# EAGLE design shield-iblock (EAGLE 9.6.1)
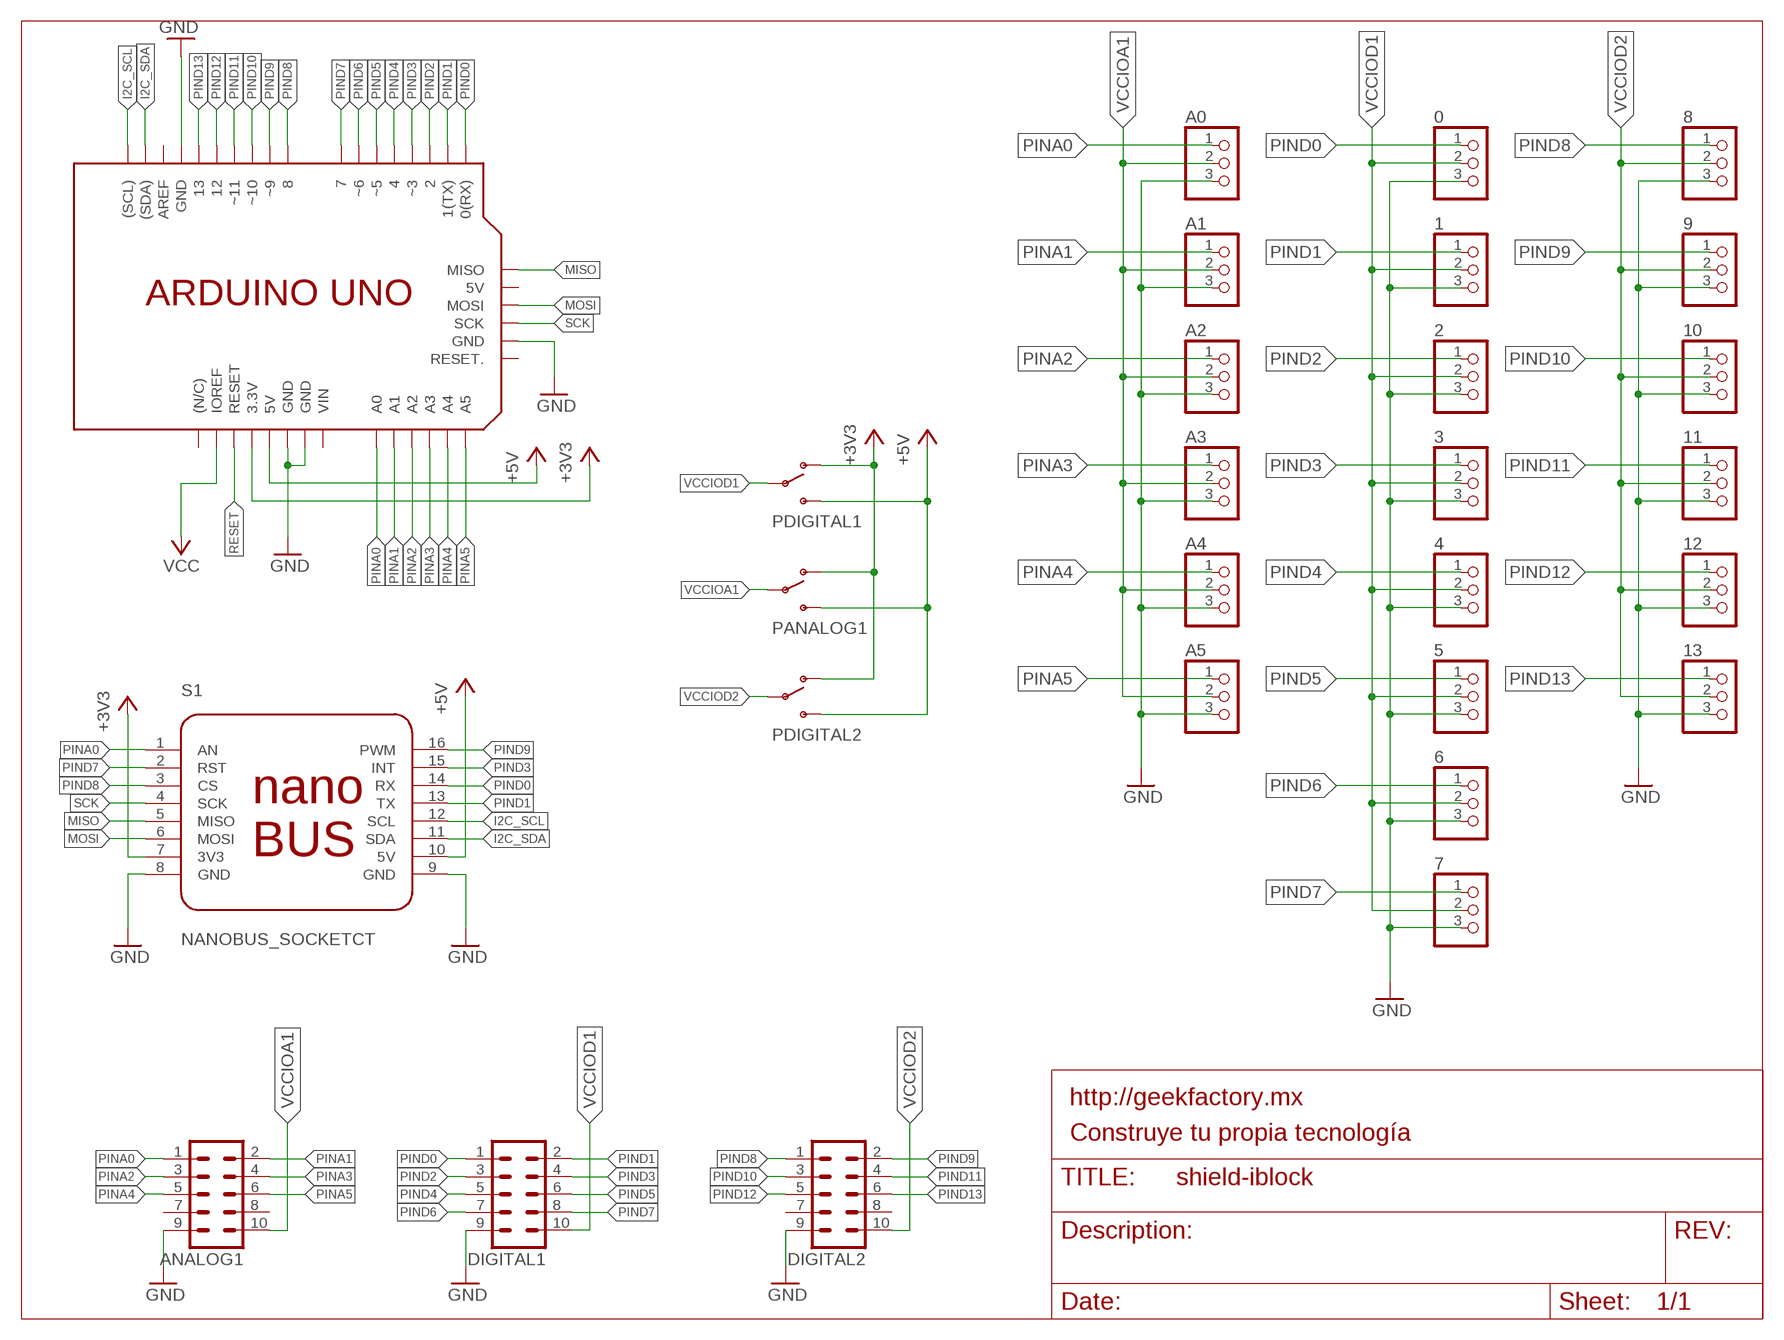
[diagram p0: schematic, sheet 1]

## Parts
0  PINHD-1X3  [1X03]
1  PINHD-1X3  [1X03]
2  PINHD-1X3  [1X03]
3  PINHD-1X3  [1X03]
4  PINHD-1X3  [1X03]
5  PINHD-1X3  [1X03]
6  PINHD-1X3  [1X03]
7  PINHD-1X3  [1X03]
8  PINHD-1X3  [1X03]
9  PINHD-1X3  [1X03]
10  PINHD-1X3  [1X03]
11  PINHD-1X3  [1X03]
12  PINHD-1X3  [1X03]
13  PINHD-1X3  [1X03]
A0  PINHD-1X3  [1X03]
A1  PINHD-1X3  [1X03]
A2  PINHD-1X3  [1X03]
A3  PINHD-1X3  [1X03]
A4  PINHD-1X3  [1X03]
A5  PINHD-1X3  [1X03]
ANALOG1  MA05-2A  [MA05-2A]
ARDUINO1  ARDUINO_UNO_NHNBR  [ARDUINO_UNO_NH_NB_ROUND]
DIGITAL1  MA05-2A  [MA05-2A]
DIGITAL2  MA05-2A  [MA05-2A]
PANALOG1  SWITCH-SPSTPTH  [SWITCH-SPDT]
PDIGITAL1  SWITCH-SPSTPTH  [SWITCH-SPDT]
PDIGITAL2  SWITCH-SPSTPTH  [SWITCH-SPDT]
S1  NANOBUS_SOCKETCT  [NANOBUS_CONNECTOR_CLEAR_TOP]

## Nets
+3V3: ARDUINO1.3V3(3.3V) PANALOG1.1(O) PDIGITAL1.1(O) PDIGITAL2.1(O) S1.7(3V3)
+5V: ARDUINO1.5V PANALOG1.3(S) PDIGITAL1.3(S) PDIGITAL2.3(S) S1.10(5V)
GND: 0.3 1.3 2.3 3.3 4.3 5.3 6.3 7.3 8.3 9.3 10.3 11.3 12.3 13.3 A0.3 A1.3 A2.3 A3.3 A4.3 A5.3 ANALOG1.9 ARDUINO1.GND ARDUINO1.GND.(GND) ARDUINO1.GND..(GND) ARDUINO1.GND_(GND) DIGITAL1.9 DIGITAL2.9 S1.8(GND) S1.9(GND)
I2C_SCL: ARDUINO1.SCL((SCL)) S1.12(SCL)
I2C_SDA: ARDUINO1.SDA((SDA)) S1.11(SDA)
MISO: ARDUINO1.MISO S1.5(MISO)
MOSI: ARDUINO1.MOSI S1.6(MOSI)
PINA0: A0.1 ANALOG1.1 ARDUINO1.A0 S1.1(AN)
PINA1: A1.1 ANALOG1.2 ARDUINO1.A1
PINA2: A2.1 ANALOG1.3 ARDUINO1.A2
PINA3: A3.1 ANALOG1.4 ARDUINO1.A3
PINA4: A4.1 ANALOG1.5 ARDUINO1.A4
PINA5: A5.1 ANALOG1.6 ARDUINO1.A5
PIND0: 0.1 ARDUINO1.0(0(RX)) DIGITAL1.1 S1.14(RX)
PIND1: 1.1 ARDUINO1.1(1(TX)) DIGITAL1.2 S1.13(TX)
PIND2: 2.1 ARDUINO1.2 DIGITAL1.3
PIND3: 3.1 ARDUINO1.3(~3) DIGITAL1.4 S1.15(INT)
PIND4: 4.1 ARDUINO1.4 DIGITAL1.5
PIND5: 5.1 ARDUINO1.5(~5) DIGITAL1.6
PIND6: 6.1 ARDUINO1.6(~6) DIGITAL1.7
PIND7: 7.1 ARDUINO1.7 DIGITAL1.8 S1.2(RST)
PIND8: 8.1 ARDUINO1.8 DIGITAL2.1 S1.3(CS)
PIND9: 9.1 ARDUINO1.9(~9) DIGITAL2.2 S1.16(PWM)
PIND10: 10.1 ARDUINO1.10(~10) DIGITAL2.3
PIND11: 11.1 ARDUINO1.11(~11) DIGITAL2.4
PIND12: 12.1 ARDUINO1.12 DIGITAL2.5
PIND13: 13.1 ARDUINO1.13 DIGITAL2.6
RESET: ARDUINO1.RST(RESET)
SCK: ARDUINO1.SCK S1.4(SCK)
VCC: ARDUINO1.IOR(IOREF)
VCCIOA1: A0.2 A1.2 A2.2 A3.2 A4.2 A5.2 ANALOG1.10 PANALOG1.2(P)
VCCIOD1: 0.2 1.2 2.2 3.2 4.2 5.2 6.2 7.2 DIGITAL1.10 PDIGITAL1.2(P)
VCCIOD2: 8.2 9.2 10.2 11.2 12.2 13.2 DIGITAL2.10 PDIGITAL2.2(P)
Unconnected: ANALOG1.7 ANALOG1.8 ARDUINO1.+5V(5V) ARDUINO1.AREF ARDUINO1.NC((N/C)) ARDUINO1.RESET. ARDUINO1.VIN DIGITAL2.7 DIGITAL2.8

## Library data of the parts
0 1-13 A0 A1-A5 = adafruit:PINHD-1X3: PIN HEADER
ANALOG1 DIGITAL1 DIGITAL2 = various-electromechanical:MA05-2: PIN HEADER
ARDUINO1 = arduino 2:ARDUINO_UNO
PANALOG1 PDIGITAL1 PDIGITAL2 = various-electromechanical:SWITCH-SPST: SPST Switch Simple slide switch. Spark Fun Electronics SKU : COM-00102
S1 = nanobus:NANOBUS_SOCKET

## Board
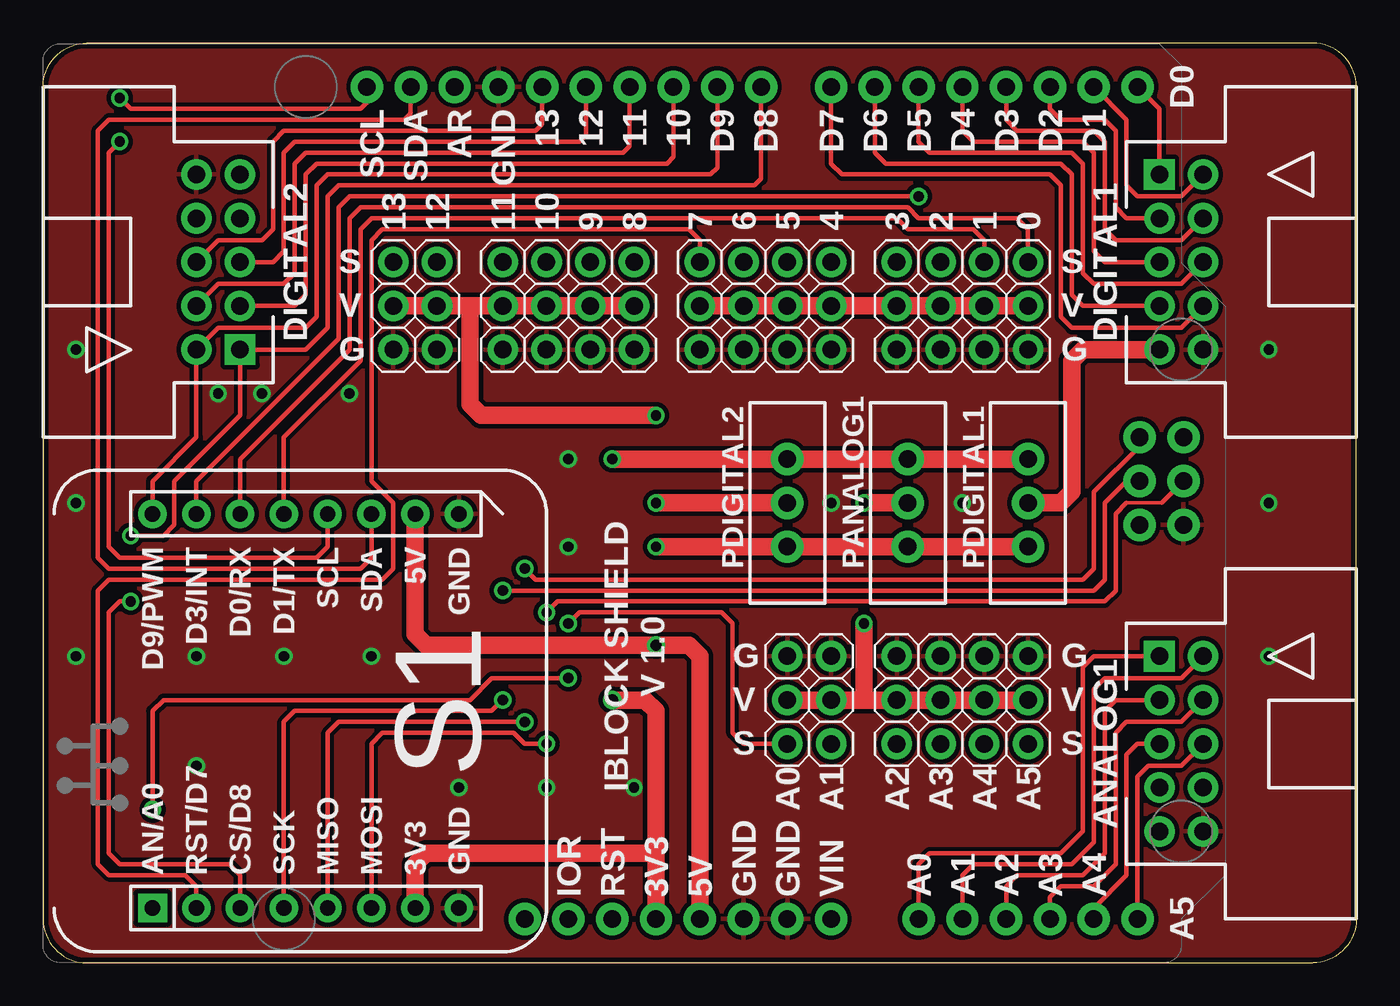
[diagram p1: board, top side]
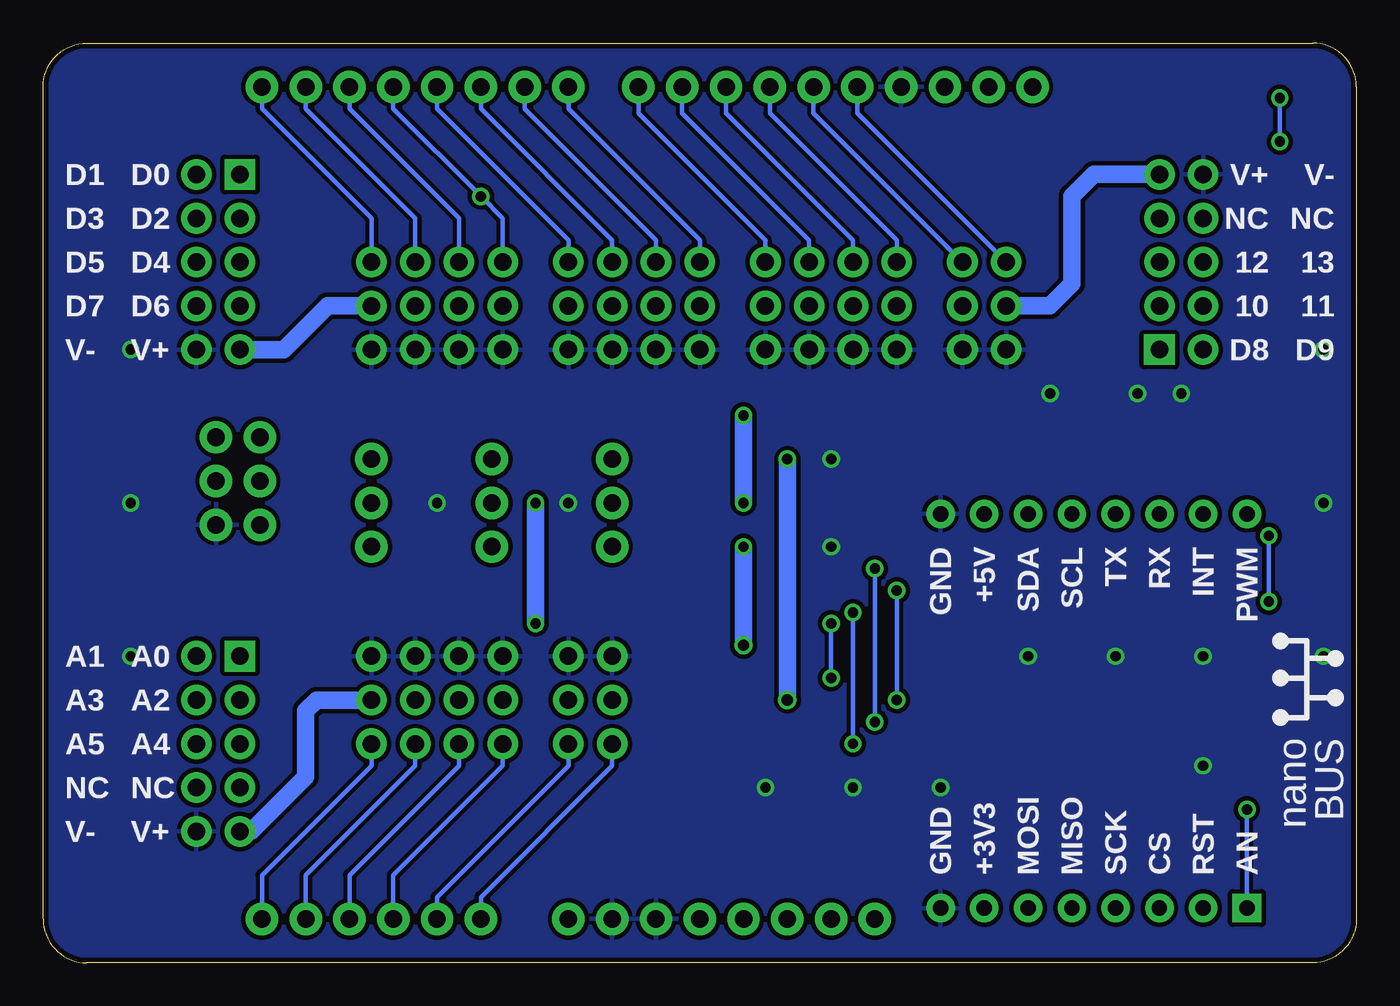
[diagram p2: board, bottom side, seen from below]

Size 76.2 x 53.34 mm. Coordinates in mm from the lower left corner, seen from the top.
Outline: 2.54,0 73.66,0 arc90 76.2,2.54 76.2,50.8 arc90 73.66,53.34 2.54,53.34 arc90 0,50.8 0,2.54 arc90 2.54,0
Copper layers (1*16): Top 0.035mm / dielectric 1.5mm / Bottom 0.035mm
Design rules "10mil_generic": minimum track width 10mil, minimum drill 0.6mm, track to track 10mil, track to pad 10mil, pad to pad 10mil, via to via 10mil, smd to smd 10mil, copper to edge 12mil, drill to drill 8mil, minimum pad ring 15mil, minimum via ring 8mil, stop-mask expansion 4mil, vias tented up to drill 0.6mm, thermal gap 10mil

### Footprints (pad centres in the part's own frame; a part is rotated, then mirrored left to right if it is on the bottom)
1X03 = drill 1.016: 1 -2.54,0; 2 0,0; 3 2.54,0
MA05-2A = drill 1.016 square: 1 1.27,-5.08 | drill 1.016: 2 -1.27,-5.08; 3 1.27,-2.54; 4 -1.27,-2.54; 5 1.27,0; 6 -1.27,0; 7 1.27,2.54; 8 -1.27,2.54; 9 -1.27,5.08; 10 1.27,5.08
ARDUINO_UNO_NH_NB_ROUND = drill 1.016 pad 1.88: 0 63.5,50.8; 1 60.96,50.8; 2 58.42,50.8; 3 55.88,50.8; 3V3 35.56,2.54; 4 53.34,50.8; 5 50.8,50.8; 5V 38.1,2.54; 6 48.26,50.8; 7 45.72,50.8; 8 41.656,50.8; 9 39.116,50.8; 10 36.576,50.8; 11 34.036,50.8; 12 31.496,50.8; 13 28.956,50.8; +5V 66.167,30.48; A0 50.8,2.54; A1 53.34,2.54; A2 55.88,2.54; A3 58.42,2.54; A4 60.96,2.54; A5 63.5,2.54; AREF 23.876,50.8; GND 26.416,50.8; GND. 43.18,2.54; GND.. 40.64,2.54; GND_ 66.167,25.4; IOR 30.48,2.54; MISO 63.627,30.48; MOSI 66.167,27.94; NC 27.94,2.54; RESET. 63.627,25.4; RST 33.02,2.54; SCK 63.627,27.94; SCL 18.796,50.8; SDA 21.336,50.8; VIN 45.72,2.54
SWITCH-SPDT = drill 1.016 pad 1.88: 1 0,2.54; 2 0,0; 3 0,-2.54
NANOBUS_CONNECTOR_CLEAR_TOP = drill 0.889 pad 1.676 square: 1 -11.43,8.89 | drill 0.889 pad 1.524: 2 -11.43,6.35; 3 -11.43,3.81; 4 -11.43,1.27; 5 -11.43,-1.27; 6 -11.43,-3.81; 7 -11.43,-6.35; 8 -11.43,-8.89; 9 11.43,-8.89; 10 11.43,-6.35; 11 11.43,-3.81; 12 11.43,-1.27; 13 11.43,1.27; 14 11.43,3.81; 15 11.43,6.35; 16 11.43,8.89

### Placement (x,y rotation side)
0  57.15,38.1 270 top
1  54.61,38.1 270 top
2  52.07,38.1 270 top
3  49.53,38.1 270 top
4  45.72,38.1 270 top
5  43.18,38.1 270 top
6  40.64,38.1 270 top
7  38.1,38.1 270 top
8  34.29,38.1 270 top
9  31.75,38.1 270 top
10  29.21,38.1 270 top
11  26.67,38.1 270 top
12  22.86,38.1 270 top
13  20.32,38.1 270 top
A0  43.18,15.24 90 top
A1  45.72,15.24 90 top
A2  49.53,15.24 90 top
A3  52.07,15.24 90 top
A4  54.61,15.24 90 top
A5  57.15,15.24 90 top
ANALOG1  66.04,12.7 180 top
ARDUINO1  0,0 0 top
DIGITAL1  66.04,40.64 180 top
DIGITAL2  10.16,40.64 0 top
PANALOG1  50.16,26.67 0 top
PDIGITAL1  57.15,26.67 0 top
PDIGITAL2  43.18,26.67 0 top
S1  15.24,14.61 90 top

### Tracks (layer width: path | path; a pad name or v marks a point on that pad's centre or on a via)
+3V3  (via drill 0.6, 0.65)
  Top 1.016: S1.7 21.59,5.71 22.23,6.35 35.56,6.35 | 35.56,6.35 ARDUINO1.3V3 | 35.56,6.35 35.56,14.61 34.92,15.24 v33.02,15.24 | v33.02,29.21 PDIGITAL2.1 PANALOG1.1 PDIGITAL1.1
  Bottom 1.016: v33.02,15.24 v33.02,29.21
+5V  (via drill 0.6, 0.65)
  Top 1.016: S1.10 21.59,19.05 22.23,18.41 v35.56,18.41 37.47,18.41 38.1,17.78 ARDUINO1.5V | v35.56,24.13 PDIGITAL2.3 PANALOG1.3 PDIGITAL1.3
  Bottom 1.016: v35.56,24.13 v35.56,18.41
GND  (via drill 0.6)
  other vias: 10.16,33.02 17.78,33.02 12.7,33.02 30.48,29.21 30.48,24.13 8.89,11.43 8.89,17.78 13.97,17.78 19.05,17.78 71.12,35.56 71.12,26.67 71.12,17.78 1.91,35.56 1.91,26.67 1.91,17.78 53.34,26.67 45.72,26.67 24.13,10.16 29.21,10.16 34.29,10.16
  pour Top (isolate 0.254): 0,53.34 0,0 76.2,0 76.2,53.34
  pour Bottom (isolate 0.254): 0,0 0,53.34 76.2,53.34 76.2,0
I2C_SCL  (via drill 0.6)
  Top 0.254: S1.12 16.51,24.13 15.88,23.5 4.45,23.5 3.81,24.13 3.81,46.99 v4.45,47.62 | v4.45,50.16 5.08,49.53 18.41,49.53 18.8,49.91 ARDUINO1.SCL
  Bottom 0.254: v4.45,47.62 v4.45,50.16
I2C_SDA
  Top 0.254: S1.11 19.05,23.5 18.41,22.86 3.81,22.86 3.17,23.5 3.17,48.26 3.81,48.9 20.95,48.9 21.34,49.28 ARDUINO1.SDA
MISO  (via drill 0.6)
  Top 0.254: S1.5 16.51,13.34 17.14,13.97 v27.94,13.97 | v27.94,22.86 28.57,22.23 60.33,22.23 60.96,22.86 60.96,27.3 63.63,29.97 ARDUINO1.MISO
  Bottom 0.254: v27.94,13.97 v27.94,22.86
MOSI  (via drill 0.6)
  Top 0.203: 62.87,26.67 64.9,26.67
  Top 0.254: S1.6 19.05,12.7 19.68,13.34 27.3,13.34 27.94,12.7 v29.21,12.7 | 64.9,26.67 ARDUINO1.MOSI | v29.21,20.32 29.84,20.95 61.59,20.95 62.23,21.59 62.23,26.04 62.87,26.67
  Bottom 0.254: v29.21,20.32 v29.21,12.7
PINA0  (via drill 0.6)
  Top 0.254: ARDUINO1.A0 50.8,5.71 51.44,6.35 59.05,6.35 60.33,7.62 60.33,17.14 60.96,17.78 ANALOG1.1 | v6.35,8.89 6.35,14.61 6.99,15.24 24.77,15.24 26.04,16.51 v30.48,16.51 | A0.1 40.64,12.7 40.01,13.34 40.01,19.68 39.37,20.32 31.11,20.32 v30.48,19.68
  Bottom 0.254: ARDUINO1.A0 50.8,3.81 43.18,11.43 A0.1 | S1.1 v6.35,8.89 | v30.48,19.68 v30.48,16.51
PINA1
  Top 0.254: ARDUINO1.A1 53.34,5.08 53.98,5.71 59.69,5.71 60.96,6.99 60.96,15.88 61.59,16.51 66.04,16.51 ANALOG1.2
  Bottom 0.254: ARDUINO1.A1 53.34,3.81 45.72,11.43 A1.1
PINA2
  Top 0.254: ARDUINO1.A2 55.88,4.45 56.52,5.08 60.33,5.08 61.59,6.35 61.59,14.61 62.23,15.24 ANALOG1.3
  Bottom 0.254: A2.1 49.53,11.43 55.88,5.08 ARDUINO1.A2
PINA3
  Top 0.254: ARDUINO1.A3 58.42,3.81 59.05,4.45 60.96,4.45 62.23,5.71 62.23,13.34 62.87,13.97 66.04,13.97 ANALOG1.4
  Bottom 0.254: A3.1 52.07,11.43 58.42,5.08 ARDUINO1.A3
PINA4
  Top 0.254: ARDUINO1.A4 60.96,3.17 62.87,5.08 62.87,12.06 63.5,12.7 ANALOG1.5
  Bottom 0.254: A4.1 54.61,11.43 60.96,5.08 ARDUINO1.A4
PINA5
  Top 0.254: ARDUINO1.A5 63.5,10.79 64.14,11.43 66.04,11.43 ANALOG1.6
  Bottom 0.254: A5.1 57.15,11.43 63.5,5.08 ARDUINO1.A5
PIND0
  Top 0.254: ARDUINO1.0 64.77,49.53 DIGITAL1.1 | S1.14 11.43,29.21 17.78,35.56 17.78,43.18 18.41,43.81 50.16,43.81 50.8,43.18 56.52,43.18 57.15,42.55 0.1
  Bottom 0.254: ARDUINO1.0 63.5,49.53 57.15,43.18 0.1
PIND1
  Top 0.254: ARDUINO1.1 62.87,48.9 62.87,45.09 63.5,44.45 66.04,44.45 DIGITAL1.2 | S1.13 13.97,30.48 18.41,34.92 18.41,42.55 19.05,43.18 49.53,43.18 50.16,42.55 53.98,42.55 54.61,41.91 1.1
  Bottom 0.254: ARDUINO1.1 60.96,49.53 54.61,43.18 1.1
PIND2
  Top 0.254: ARDUINO1.2 58.42,49.53 59.05,48.9 61.59,48.9 62.23,48.26 62.23,43.81 62.87,43.18 DIGITAL1.3
  Bottom 0.254: ARDUINO1.2 58.42,49.53 52.07,43.18 2.1
PIND3  (via drill 0.6)
  Top 0.254: ARDUINO1.3 55.88,48.9 56.52,48.26 60.96,48.26 61.59,47.62 61.59,42.55 62.23,41.91 66.04,41.91 DIGITAL1.4 | S1.15 8.89,27.94 17.14,36.2 17.14,43.81 17.78,44.45 v50.8,44.45
  Bottom 0.254: ARDUINO1.3 55.88,49.53 v50.8,44.45 49.53,43.18 3.1
PIND4
  Top 0.254: ARDUINO1.4 53.34,48.26 53.98,47.62 60.33,47.62 60.96,46.99 60.96,41.27 61.59,40.64 DIGITAL1.5
  Bottom 0.254: ARDUINO1.4 53.34,49.53 45.72,41.91 4.1
PIND5
  Top 0.254: ARDUINO1.5 50.8,47.62 51.44,46.99 59.69,46.99 60.33,46.35 60.33,40.01 60.96,39.37 66.04,39.37 DIGITAL1.6
  Bottom 0.254: ARDUINO1.5 50.8,49.53 43.18,41.91 5.1
PIND6
  Top 0.254: ARDUINO1.6 48.26,46.99 48.9,46.35 59.05,46.35 59.69,45.72 59.69,38.73 60.33,38.1 DIGITAL1.7
  Bottom 0.254: ARDUINO1.6 48.26,49.53 40.64,41.91 6.1
PIND7
  Top 0.254: ARDUINO1.7 45.72,46.35 46.35,45.72 58.42,45.72 59.05,45.09 59.05,37.47 59.69,36.83 66.04,36.83 DIGITAL1.8 | 7.1 38.1,41.91 37.47,42.55 19.68,42.55 19.05,41.91 19.05,27.94 20.32,26.67 20.32,22.86 19.68,22.23 3.81,22.23 3.17,21.59 3.17,5.71 3.81,5.08 8.26,5.08 8.89,4.45 S1.2
  Bottom 0.254: ARDUINO1.7 45.72,49.53 38.1,41.91 7.1
PIND8  (via drill 0.6)
  Top 0.254: ARDUINO1.8 41.66,45.47 41.27,45.09 17.14,45.09 16.51,44.45 16.51,36.83 15.24,35.56 DIGITAL2.1 11.43,31.75 7.62,27.94 7.62,25.4 6.99,24.77 v5.08,24.77 | S1.3 11.43,5.08 10.79,5.71 4.45,5.71 3.81,6.35 3.81,20.32 4.45,20.95 v5.08,20.95
  Bottom 0.254: ARDUINO1.8 41.66,49.28 34.29,41.91 8.1 | v5.08,20.95 v5.08,24.77
PIND9
  Top 0.254: ARDUINO1.9 39.12,46.1 38.73,45.72 16.51,45.72 15.88,45.09 15.88,37.47 15.24,36.83 10.16,36.83 DIGITAL2.2 8.89,30.48 6.35,27.94 S1.16
  Bottom 0.254: ARDUINO1.9 39.12,49.28 31.75,41.91 9.1
PIND10
  Top 0.254: ARDUINO1.10 36.58,46.74 36.2,46.35 15.88,46.35 15.24,45.72 15.24,38.73 14.61,38.1 DIGITAL2.3
  Bottom 0.254: ARDUINO1.10 36.58,49.28 29.21,41.91 10.1
PIND11
  Top 0.254: ARDUINO1.11 34.04,47.37 33.66,46.99 15.24,46.99 14.61,46.35 14.61,40.01 13.97,39.37 10.16,39.37 DIGITAL2.4
  Bottom 0.254: ARDUINO1.11 34.04,49.28 26.67,41.91 11.1
PIND12
  Top 0.254: ARDUINO1.12 31.5,48.01 31.11,47.62 14.61,47.62 13.97,46.99 13.97,41.27 13.34,40.64 DIGITAL2.5
  Bottom 0.254: ARDUINO1.12 31.5,49.28 12.1
PIND13
  Top 0.254: DIGITAL2.6 10.16,41.91 12.7,41.91 13.34,42.55 13.34,47.62 13.97,48.26 24.13,48.26 28.57,48.26 28.96,48.64 ARDUINO1.13
  Bottom 0.254: ARDUINO1.13 28.96,49.28 13.1
SCK  (via drill 0.6)
  Top 0.254: S1.4 13.97,13.97 14.61,14.61 26.04,14.61 v26.67,15.24 | v26.67,21.59 60.96,21.59 61.59,22.23 61.59,26.67 62.87,27.94 ARDUINO1.SCK
  Bottom 0.254: v26.67,15.24 v26.67,21.59
VCCIOA1  (via drill 0.6)
  Top 1.016: A0.2 A1.2 47.62,15.24 | 47.62,15.24 A2.2 A3.2 A4.2 A5.2 | v47.62,19.68 47.62,15.24 | v47.62,26.67 PANALOG1.2
  Bottom 1.016: v47.62,26.67 v47.62,19.68 | A5.2 60.33,15.24 60.96,14.61 60.96,10.79 64.14,7.62 ANALOG1.10
VCCIOD1
  Top 1.016: 7.2 6.2 5.2 4.2 3.2 2.2 1.2 0.2 | DIGITAL1.10 60.33,35.56 59.69,34.92 59.69,27.3 59.05,26.67 PDIGITAL1.2
  Bottom 1.016: DIGITAL1.10 62.23,35.56 59.69,38.1 0.2
VCCIOD2  (via drill 0.6)
  Top 1.016: 8.2 9.2 10.2 11.2 24.77,38.1 | 24.77,38.1 12.2 13.2 | v35.56,31.75 25.4,31.75 24.77,32.38 24.77,38.1 | v35.56,26.67 PDIGITAL2.2
  Bottom 1.016: DIGITAL2.10 15.24,45.72 16.51,44.45 16.51,39.37 17.78,38.1 13.2 | v35.56,26.67 v35.56,31.75

### Text on the board
tPlace: D0 | SCL | SDA | AR | GND | 13 | 12 | 11 | 10 | D9 | D8 | D7 | D6 | D5 | D4 | D3 | D2 | D1 | S | S | V | V | G | G | D9/PWM | D3/INT | D0/RX | D1/TX | SCL | SDA | 5V | GND | IBLOCK SHIELD / V 1.0 | G | G | V | V | S | S | AN/A0 | RST/D7 | CS/D8 | SCK | MISO | MOSI | 3V3 | GND | IOR | RST | 3V3 | 5V | GND | GND | VIN | A0 | A1 | A2 | A3 | A4 | A5
bPlace: V- | V+ | D0 | D1 | NC | NC | D2 | D3 | 13 | 12 | D4 | D5 | 11 | 10 | D6 | D7 | D9 | D8 | V+ | V- | A0 | A1 | A2 | A3 | A4 | A5 | NC | NC | V+ | V-